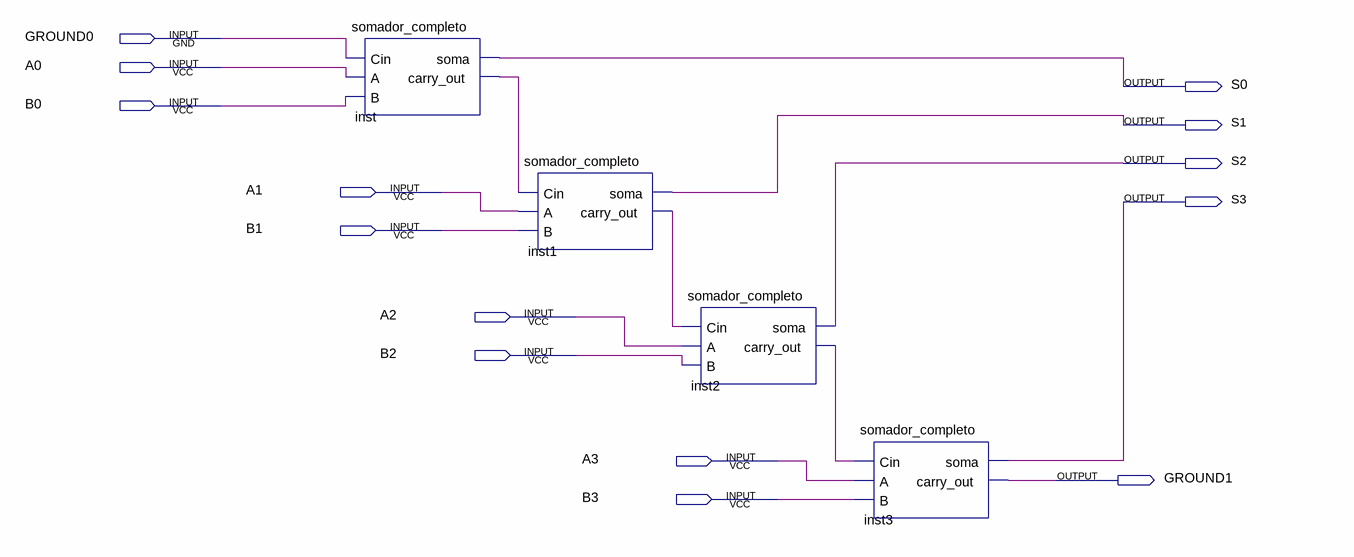
[diagram p0: schematic sheet]
// Quartus schematic soma_4_bits.bdf as structural Verilog: 4 symbols, 14 pins
module soma_4_bits (
  input  GROUND0,
  input  A0,
  input  B0,
  input  A1,
  input  B1,
  input  A2,
  input  B2,
  input  A3,
  input  B3,
  output S0,
  output S1,
  output S2,
  output S3,
  output GROUND1
);

  wire inst1_carry_out, inst2_carry_out, inst_carry_out;

  somador_completo inst (.Cin(GROUND0), .A(A0), .B(B0), .soma(S0), .carry_out(inst_carry_out));
  somador_completo inst1 (.Cin(inst_carry_out), .A(A1), .B(B1), .soma(S1), .carry_out(inst1_carry_out));
  somador_completo inst2 (.Cin(inst1_carry_out), .A(A2), .B(B2), .soma(S2), .carry_out(inst2_carry_out));
  somador_completo inst3 (.Cin(inst2_carry_out), .A(A3), .B(B3), .soma(S3), .carry_out(GROUND1));
endmodule
